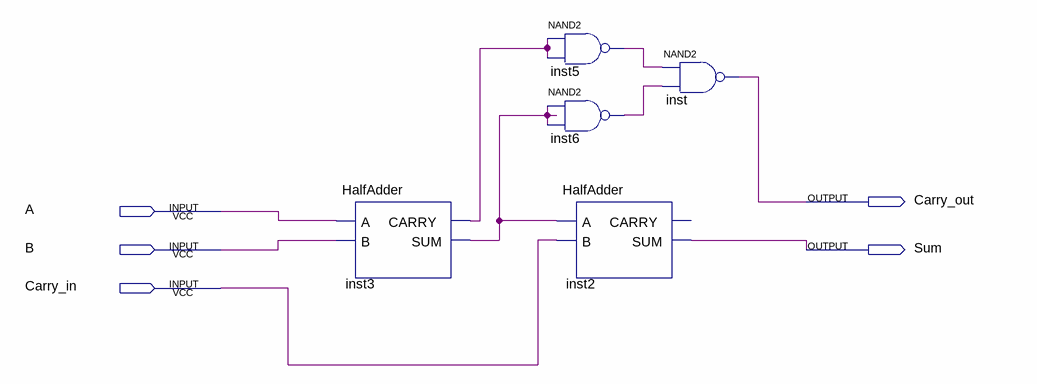
[diagram p0: schematic sheet]
// Quartus schematic FullAdder.bdf as structural Verilog: 5 symbols, 5 pins
module FullAdder (
  input  A,
  input  B,
  input  Carry_in,
  output Carry_out,
  output Sum
);

  wire inst3_carry, inst3_sum, inst5_out, inst6_out;

  HalfAdder inst3 (.A(A), .B(B), .CARRY(inst3_carry), .SUM(inst3_sum));
  nand inst5 (inst5_out, inst3_carry, inst3_carry);
  nand inst6 (inst6_out, inst3_sum, inst3_sum);
  HalfAdder inst2 (.A(inst3_sum), .B(Carry_in), .SUM(Sum));  // open: CARRY
  nand inst (Carry_out, inst5_out, inst6_out);
endmodule
